# Altium schematic sheet Microcontroller.SchDoc: MCU & Power management
size 420 x 297 mm; ENG_APP_DATE: --/--/--; DSN_APP_DATE: --/--/--; CHK_APP_DATE: --/--/--
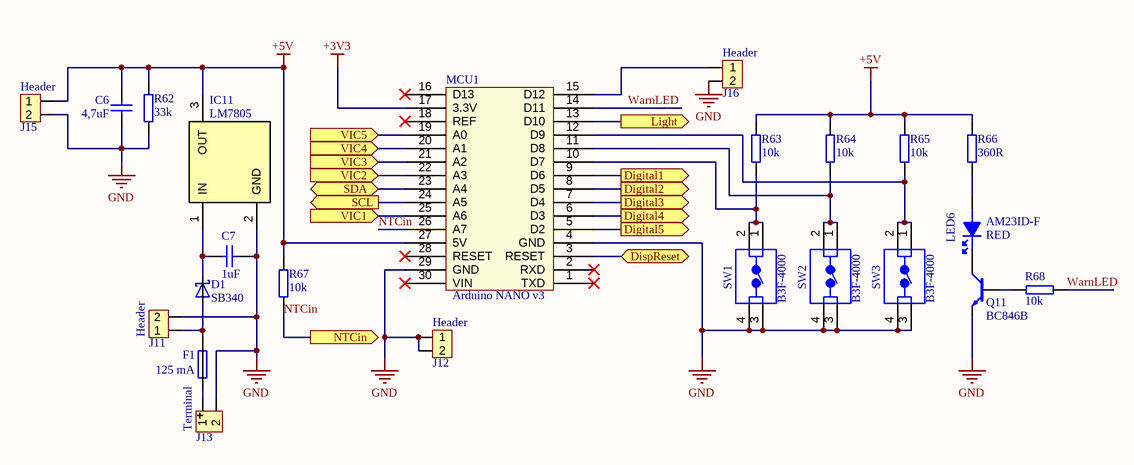
[diagram p0: Microcontroller.SchDoc]

## Parts
C6  Name: 4,7uF  [C_0805]  (hidden comment: 4,7uF_35V)
C7  Name: 1uF  [C_0805]  (hidden comment: 1uF_35V)
D1  Name: SB340  [DO-201AD]  (hidden comment: SB340_DO-201AD)
F1  value 125 mA  [FUSE_5x20]  (hidden comment: PTF0078P)
IC11  Name: LM7805  [TO220]  (hidden comment: LM7805_TO220)
J11  Name: Header  [HDR_1x2_2.54mm-MALE]  (hidden comment: 2.54mm pitch)
J12  Name: Header  [HDR_1x2_2.54mm-MALE]  (hidden comment: 2.54mm pitch)
J13  Name: Terminal  [TERMINAL_90_5MM]  (hidden comment: 5mm pitch)
J15  Name: Header  [HDR_1x2_2.54mm-MALE]  (hidden comment: 2.54mm pitch)
J16  Name: Header  [HDR_1x2_2.54mm-MALE]  (hidden comment: 2.54mm pitch)
LED6  Name: RED  Manufacturer Part Number: AM23ID-F  [LED_SOT23]  (hidden comment: LED_SOT23)
MCU1  Name: Arduino NANO v3  [Arduino_Nano_V3.0]  (hidden comment: Arduino NANO v 3.0)
Q11  Name: BC846B  [NPN_BJT_SOT23]  (hidden comment: BC846B_SOT23)
R62  Name: 33k  [R_0805]  (hidden comment: 33k_125mW)
R63  Name: 10k  [R_0805]  (hidden comment: 10k_125mW)
R64  Name: 10k  [R_0805]  (hidden comment: 10k_125mW)
R65  Name: 10k  [R_0805]  (hidden comment: 10k_125mW)
R66  Name: 360R  [R_0805]  (hidden comment: 360R_125mW)
R67  Name: 10k  [R_0805]  (hidden comment: 10k_125mW)
R68  Name: 10k  [R_0805]  (hidden comment: 10k_125mW)
SW1  B3F-4000  [PUSH_BUTTON]
SW2  B3F-4000  [PUSH_BUTTON]
SW3  B3F-4000  [PUSH_BUTTON]

## Ports
Digital1 (out), Digital2 (out), Digital3 (out), Digital4 (out), Digital5 (out), DispReset (bidir), Light (out), NTCin (out), SCL (out), SDA (bidir), VIC1 (in), VIC2 (in), VIC3 (in), VIC4 (in), VIC5 (in)

## Nets
+3V3: MCU1.17(3.3V)
+5V: C6.2 IC11.3(OUT) J15.1 MCU1.27(5V) R62.1 R63.2 R64.2 R65.2 R66.1 R67.1
GND: C6.1 C7.2 IC11.2(GND) J11.2 J12.1 J12.2 J13.2 J15.2 J16.2 MCU1.4(GND) MCU1.29(GND) Q11.3(E) R62.2 SW1.3 SW1.4 SW2.3 SW2.4 SW3.3 SW3.4
Digital1: MCU1.9(D6) ; port Digital1
Digital2: MCU1.8(D5) ; port Digital2
Digital3: MCU1.7(D4) ; port Digital3
Digital4: MCU1.6(D3) ; port Digital4
Digital5: MCU1.5(D2) ; port Digital5
DispReset: MCU1.3(RESET) ; port DispReset
Light: MCU1.13(D10) ; port Light
NTCin: MCU1.26(A7) R67.2 ; port NTCin
SCL: MCU1.24(A5) ; port SCL
SDA: MCU1.23(A4) ; port SDA
VIC1: MCU1.25(A6) ; port VIC1
VIC2: MCU1.22(A3) ; port VIC2
VIC3: MCU1.21(A2) ; port VIC3
VIC4: MCU1.20(A1) ; port VIC4
VIC5: MCU1.19(A0) ; port VIC5
WarnLED: MCU1.14(D11) R68.1
NetC7_1: C7.1 D1.2 IC11.1(IN)
NetD1_1: D1.1 F1.2 J11.1
NetF1_1: F1.1 J13.1
NetJ16_1: J16.1 MCU1.15(D12)
NetLED6_1: LED6.1(A) R66.2
NetLED6_3: LED6.3(K) Q11.1(C)
NetMCU1_10: MCU1.10(D7) R63.1 SW1.1 SW1.2
NetMCU1_11: MCU1.11(D8) R64.1 SW2.1 SW2.2
NetMCU1_12: MCU1.12(D9) R65.1 SW3.1 SW3.2
NetQ11_2: Q11.2(B) R68.2

Not connected (* = marked no-connect by the designer): MCU1 1(TXD)* 2(RXD)* 16(D13)* 18(REF)* 28(RESET)* 30(VIN)*

## Notes on the sheet
- THIS DOCUMENT AND THE DATA DISCLOSED HEREIN OR
- HEREWITH IS THE PROPERTY OF ALTIUM LIMITED AND MAY
- DWG NO:
- REVISION
- REV:
- DESCRIPTION
- DATE
- APPROVED
- BE FREELY DISTRIBUTED IN WHOLE. NO RIGHTS ARE
- RESERVED OR EXPRESS OR IMPLIED WARANTEE GIVEN.
- ENG:
- APPROVALS
- PROJECT
- DSN:
- CHK:
- REFERENCE DOCUMENTS
- PROJECT REVISION:
- TITLE
- DOCUMENT REVISION:
- DESIGN ITEM:
- BOM:
- FAB DWG:
- PCB DWG:
- ASSY DWG:
- SCALE:
- A3
- SIZE
- CAGE CODE
- FILE NAME
- DWG NO.
- SHEET
- OF
- REV

## Library data of the parts
C6 = C_4,7uF_0805: Capacitor [SMD]; Manufacturer: Murata; Manufacturer Part Number: GRM21BR61H475KE51L; Capacitance: 4.7uF; Dielectric: X5R; Material: Ceramic; Tolerance: 10%; Voltage Rating: 50V; ComponentLink1Description: DATASHEET; ComponentLink1URL: https://hr.mouser.com/datasheet/2/281/1/GRM21BR61H475KE51_01A-1987025.pdf; ComponentLink2Description: BUY; ComponentLink2URL: https://hr.mouser.com/ProductDetail/Murata-Electronics/GRM21BR61H475KE51L?qs=eeBpzGFlv%252B%252BOtLzDC1PY6Q%3D%3D; Supplier 1: Mouser; Supplier Part Number 1: 81-GRM21BR61H475KE1L; Case Code (Imperial): 0805; Case Code (Metric): 2012; Case/Package: 0805; Depth: 1.25mm; Height: 1.25mm; Lead Free: Lead Free; Length: 2mm; Max Operating Temperature: 85°C; Min Operating Temperature: -55°C; Mount: Surface Mount; Packaging: Tape and Reel; REACH SVHC: No SVHC; RoHS Compliant: Yes; Thickness: 0.055inch; Voltage Rating (DC): 50V; Width: 0.049inch; Supplier Packaging 1: Tape & Reel; Supplier Unit Price 1: $0.35; Supplier Location 1: US
C7 = C_1uF_0805: Capacitor [SMD]; Manufacturer: Murata; Manufacturer Part Number: GCJ21BR71H105KA01L; Dielectric: X7R; Tolerance: 10%; Voltage Rating: 50V; ComponentLink1Description: DATASHEET; ComponentLink1URL: https://hr.mouser.com/datasheet/2/281/GCJ21BR71H105KA01_01-1963894.pdf; ComponentLink2Description: BUY; ComponentLink2URL: https://hr.mouser.com/ProductDetail/Murata-Electronics/GCJ21BR71H105KA01L?qs=hNud%2FORuBR3CJcLH9kX5%252Bw%3D%3D; Supplier 1: Mouser; Supplier Part Number 1: 81-GCJ21BR71H105KA1L; Capacitance: 1uF; Case Code (Imperial): 0805; Case Code (Metric): 2012; Case/Package: 0805; Features: Soft Termination; Height: 1.25mm; Lead Free: Lead Free; Length: 0.079inch; Max Operating Temperature: 125°C; Min Operating Temperature: -55°C; Mount: Surface Mount; Package Quantity: 3000; Packaging: Tape and Reel; Ratings: AEC-Q200; RoHS Compliant: Yes; Termination: SMD/SMT; Thickness: 0.057inch; Voltage Rating (DC): 50V; Weight: 0.000335oz; Width: 0.049inch; Supplier Packaging 1: Tape & Reel; Supplier Unit Price 1: $0.32; Supplier Location 1: US
D1 = SB340_DO-201AD: Diode Schottky 40V 3A [TH]; Manufacturer: Vishay Semiconductors; Manufacturer Part Number: SB340-E3/54; MP: 1N5822; Value: SB340; MF: ON Semiconductor; Element Configuration: Single; Forward Voltage: 490mV; Max Forward Surge Current (Ifsm): 120A; Max Reverse Current: 500uA; Package: DO-201AD-201 Panjit; SnapEDA_Link: https://www.snapeda.com/parts/1N5822/ON%20Semiconductor/view-part/1356736/?ref=snap; Price: None; Availability: Unavailable; ComponentLink1Description: DATASHEET; ComponentLink1URL: https://hr.mouser.com/datasheet/2/427/VISH_S_A0001809294_1-2567748.pdf; ComponentLink2Description: BUY; ComponentLink2URL: https://hr.mouser.com/ProductDetail/Vishay-General-Semiconductor/SB340-E3-54?qs=u91jd7aysvMt27Sml4hAKw%3D%3D; Supplier 1: Mouser; Supplier Part Number 1: 625-SB340-E3/54; Average Rectified Current: 3A; Case/Package: DO-201AD; Forward Current: 3A; Height: 5.8mm; Lead Free: Lead Free; Length: 10mm; Max Operating Temperature: 125°C; Max Repetitive Reverse Voltage (Vrrm): 40V; Max Reverse Leakage Current: 500uA; Max Reverse Voltage (DC): 40V; Max Surge Current: 120A; Min Operating Temperature: -65°C; Mount: Through Hole; Number of Pins: 2; Package Quantity: 1400; Packaging: Tape and Reel; Peak Non-Repetitive Surge Current: 120A; Radiation Hardening: No; REACH SVHC: Unknown; RoHS Compliant: Yes; Series: -; Width: 5.8mm; Supplier Packaging 1: Tape & Reel; Supplier Unit Price 1: $0.46; Supplier Location 1: US
F1 = PTF0078P: Fuse holder [TH]; Manufacturer: Littelfuse; Manufacturer Part Number: 0PTF0078P; MP: 4527; MF: Keystone; Name: Fuse 1A; Number of Circuits: 1; Price: None; Availability: Unavailable; SnapEDA_Link: https://www.snapeda.com/parts/4527/Keystone%20Electronics/view-part/475964/?ref=snap; Package: None; ComponentLink1Description: DATASHEET; ComponentLink1URL: https://hr.mouser.com/datasheet/2/240/Littelfuse-2891966.pdf; ComponentLink2Description: BUY; ComponentLink2URL: https://hr.mouser.com/ProductDetail/Littelfuse/0PTF0078P?qs=Co4VkB5J4%2Fsczy6gG8s%2FsA%3D%3D; Supplier 1: Mouser; Supplier Part Number 1: 576-0PTF0078P; Mount: PCB; Package Quantity: 2000; Packaging: Bulk; Termination: PC Pin; Supplier Packaging 1: Bulk; Supplier Unit Price 1: $0.59; Supplier Location 1: US
IC11 = LM7805_TO220: Linear Voltage Regulator 5V [TH] with thermal pad mounted to Fischer elektronik SK09 - 20mm heatsink with a screw and nut; Manufacturer: STMicroelectronics; Manufacturer Part Number: L7805C-V; MP: LM7805CT; MF: ON Semiconductor; Dropout Voltage: 2V; Max Input Voltage: 35V; Max Output Current: 1.5A; Min Input Voltage: 7V; Number of Outputs: 1; Output Configuration: Positive; Output Type: Fixed; Power Supply Rejection Ratio (PSRR): 62dB; Quiescent Current: 8mA; Tolerance: 5%; SnapEDA_Link: https://www.snapeda.com/parts/LM7805CT/ON%20Semiconductor/view-part/546231/?ref=snap; Price: None; Package: TO-220 ON Semiconductor; Value: *; Availability: Unavailable; ComponentLink1Description: Rregulator_DATASHEET; ComponentLink1URL: https://hr.mouser.com/datasheet/2/389/cd00000444-1795274.pdf; ComponentLink2Description: Regulator_BUY; ComponentLink2URL: https://hr.mouser.com/ProductDetail/STMicroelectronics/L7805CV?qs=9NrABl3fj%2FqplZAHiYUxWg%3D%3D; Supplier 1: Mouser; Supplier Part Number 1: 511-L7805CV; Case/Package: TO-220; Contact Plating: Gold; Height: 9.15mm; Lead Free: Lead Free; Length: 10.4mm; Max Operating Temperature: 125°C; Min Operating Temperature: 0°C; Min Output Voltage: 5V; Mount: Through Hole; Nominal Output Voltage: 5V; Number of Pins: 3; Number of Regulators: 1; Output Current: 1.5A; Output Voltage: 5V; Package Quantity: 1000; Packaging: Rail/Tube; Polarity: Positive; Radiation Hardening: No; REACH SVHC: No SVHC; RoHS Compliant: Yes; Series: -; Weight: 0.08113oz; Width: 4.6mm; Supplier Packaging 1: Tube; Supplier Unit Price 1: $0.63; Supplier Location 1: US; ComponentLink3Description: Heatsink_OFFICIAL PAGE; ComponentLink3URL: https://www.fischerelektronik.de/web_fischer/en_GB/heatsinks/A01/Standard%20extruded%20heatsinks/PG/SK09/search.xhtml; ComponentLink4Description: Heatsink_BUY; ComponentLink4URL: https://www.tme.eu/en/details/sk09-20sa220/heatsinks/fischer-elektronik/sk-09-20-sa-to-220/
J11 J12 J15 J16 = Header 1x2: Header, 2-Pin [TH]; Manufacturer: Molex; Current Rating: 4A; Gender: Male; Glow Wire Compliant: Non-compliant; Number of Circuits: 15; Pitch: 0.1inch; Voltage Rating: 250V; Connector Type: Male Pin; LatestRevisionDate: 17-Jul-2002; LatestRevisionNote: Re-released for DXP Platform.; Publisher: Altium Limited; ComponentLink1Description: DATASHEET; ComponentLink1URL: https://hr.mouser.com/datasheet/2/276/0022284150_PCB_HEADERS-159054.pdf; ComponentLink2Description: BUY; ComponentLink2URL: https://hr.mouser.com/ProductDetail/Molex/22-28-4150?qs=M5Ic86%252BuP8aClMFgmZrq7g%3D%3D; Supplier 1: Mouser; Supplier Part Number 1: 538-22-28-4150; Color: Black; Contact Material: Brass; Contact Mating Length: 0.24inch; Contact Plating: Tin; Contact Type: Male Pin; Flammability Rating: UL94 V-0; Height: 2.29mm; Housing Color: Black; Housing Material: Thermoplastic; Lead Free: Contains Lead; Length: 38.1mm; Mount: Through Hole; Number of Contacts: 15; Number of Positions: 15; Number of Rows: 1; Orientation: Vertical; Package Quantity: 1; Packaging: Bulk; RoHS Compliant: Yes; Series: KK® 42375; Termination: Solder; Voltage Rating (DC): 250V; Width: 2.49mm; Supplier Packaging 1: Bulk; Supplier Unit Price 1: $0.57; Supplier Location 1: US; Manufacturer Part Number: 22-28-4150
J13 = Terminal 1x2: PCB connector, 2-Pin [TH]; Manufacturer: CUI Devices; Manufacturer Part Number: TB006-508-02BE; LatestRevisionDate: 17-Jul-2002; LatestRevisionNote: Re-released for DXP Platform.; Publisher: Altium Limited; ComponentLink1Description: DATASHEET; ComponentLink1URL: https://hr.mouser.com/datasheet/2/670/tb006_508-2306877.pdf; ComponentLink2Description: BUY; ComponentLink2URL: https://hr.mouser.com/ProductDetail/CUI-Devices/TB006-508-02BE?qs=vLWxofP3U2wEdOVV%2FaT04w%3D%3D; Supplier 1: Mouser; Supplier Part Number 1: 490-TB006-508-02BE; Supplier Unit Price 1: $0.85; Supplier Location 1: US
LED6 = LED_SOT23: Red LED [SMD]; Manufacturer: Kingbright; Dominant Wavelength: 617nm; Forward Current: 20mA; Forward Voltage: 2V; Lens Style: Diffused,Tinted; Lens Transparency: Diffused; Luminous Intensity: 7mcd; Power Rating: 75mW; Viewing Angle: 140°; Wavelength: 625nm; ComponentLink1Description: DATASHEET; ComponentLink1URL: https://hr.mouser.com/datasheet/2/216/AM23ID-F-33364.pdf; ComponentLink2Description: BUY; ComponentLink2URL: https://hr.mouser.com/ProductDetail/Kingbright/AM23ID-F?qs=y3UkhjaxUTbVf8YFp%2FiekA%3D%3D; Supplier 1: Mouser; Supplier Part Number 1: 604-AM23ID-F; Case/Package: SOT-23; Color: Red; Height: 1.2mm; Illumination Color: Red; Lead Free: Lead Free; Length: 3mm; Lens Color: Red; Max Operating Temperature: 85°C; Min Operating Temperature: -40°C; Mount: Surface Mount; Package Quantity: 2000; Packaging: Tape and Reel; RoHS Compliant: Yes; Series: -; Test Current: 20mA; Width: 1.3mm; Supplier Packaging 1: Tape & Reel; Supplier Unit Price 1: $0.50; Supplier Location 1: US
MCU1 = Arduino NANO v 3.0: Microcontroller [TH]; Manufacturer Part Number: A000005; Core Architecture: AVR; Data Bus Width: 8b; Evaluation Kit: Yes; Number of Bits: 8; Operating Supply Voltage: 20V; Interface: I2C,SPI,USB; ComponentLink1Description: OFFICIAL PAGE; ComponentLink1URL: https://store.arduino.cc/arduino-nano; Height: 0.25inch; Length: 7inch; Package Quantity: 1; Packaging: Bulk; REACH SVHC: No SVHC; Weight: 0.02lb; Width: 5inch; Manufacturer: Arduino; ComponentLink2Description: BUY; ComponentLink2URL: https://www.mouser.com/ProductDetail/Arduino/A000005?qs=FN83AlR%252Bkj%252B2HN65G4WOuA%3D%3D; Supplier 1: Mouser; Supplier Part Number 1: 782-A000005
Q11 = BC846B_SOT23: NPN transistor [SMD]; Manufacturer Part Number: BC846ALT1G; Manufacturer: ON Semiconductor; Collector Base Voltage (VCBO): 80V; Collector Emitter Breakdown Voltage: 65V; Collector Emitter Saturation Voltage: 600mV; Current Rating: 100mA; Element Configuration: Single; Emitter Base Voltage (VEBO): 6V; Frequency: 100MHz; hFE Min: 110; Max Power Dissipation: 300mW; Number of Elements: 1; ComponentLink1Description: DATASHEET; ComponentLink1URL: https://hr.mouser.com/datasheet/2/308/1/BC846ALT1_D-2310268.pdf; ComponentLink2Description: BUY; ComponentLink2URL: https://hr.mouser.com/ProductDetail/onsemi/BC846ALT1G?qs=vNc2DXHODiKaYXYnVvJi5w%3D%3D; Case/Package: SOT-23; Collector Emitter Voltage (VCEO): 65V; Collector-emitter Voltage-Max: 600mV; Contact Plating: Tin,Matte; Gain Bandwidth Product: 100MHz; Halogen Free: Halogen Free; Height: 0.94mm; Lead Free: Lead Free; Length: 2.9mm; Max Breakdown Voltage: 65V; Max Collector Current: 100mA; Max Frequency: 100MHz; Max Operating Temperature: 150°C; Min Operating Temperature: -55°C; Number of Pins: 3; Package Quantity: 1; Packaging: Tape and Reel; Polarity: NPN; Power Dissipation: 300mW; Radiation Hardening: No; REACH SVHC: No SVHC; RoHS Compliant: Yes; Series: BC846AL; Transition Frequency: 100MHz; Voltage Rating (DC): 65V; Width: 1.3mm; Supplier 1: Mouser; Supplier Part Number 1: 863-BC846ALT1G
R62 = R_33k_0805: Resistor [SMD]; Manufacturer: Vishay Dale; Manufacturer Part Number: CRCW080533K0FKEBC; Max Power Dissipation: 125mW; Resistance: 33kR; Temperature Coefficient: 100ppm/°C; Tolerance: 1%; ComponentLink1Description: DATASHEET; ComponentLink1URL: https://hr.mouser.com/datasheet/2/427/crcwce3-1762584.pdf; ComponentLink2Description: BUY; ComponentLink2URL: https://hr.mouser.com/ProductDetail/Vishay-Dale/CRCW080533K0FKEBC?qs=wd5RIQLrsJg6GD4hLX9MMA%3D%3D; Supplier 1: Mouser; Supplier Part Number 1: 71-CRCW080533K0FKEBC; Case/Package: 0805; Max Operating Temperature: 155°C; Min Operating Temperature: -55°C; Number of Terminations: 2; Packaging: Tape and Reel; Resistor Type: Thick Film; RoHS Compliant: Yes; Supplier Packaging 1: Tape & Reel; Supplier Unit Price 1: $0.16; Supplier Location 1: US
R63-R65 R67 R68 = R_10k_0805: Resistor [SMD]; Manufacturer: Vishay; Manufacturer Part Number: CRCW080510K0FKEAC; Power Rating: 125mW; Resistance: 10000R; Tolerance: 1%; ComponentLink1Description: DATASHEET; ComponentLink1URL: https://hr.mouser.com/datasheet/2/427/crcwce3-1762584.pdf; ComponentLink2Description: BUY; ComponentLink2URL: https://hr.mouser.com/ProductDetail/Vishay-Dale/CRCW080510K0FKEAC?qs=E3Y5ESvWgWORadmUijPtxQ%3D%3D; Supplier 1: Mouser; Supplier Part Number 1: 71-CRCW080510K0FKEAC; Case/Package: 0805; Lead Free: Lead Free; RoHS Compliant: Yes; Supplier Packaging 1: Tape & Reel; Supplier Unit Price 1: $0.10; Supplier Location 1: US
R66 = R_360R_0805: Resistor [SMD]; Manufacturer: Vishay; Manufacturer Part Number: CRCW0805360RFKEA; Max Power Dissipation: 125mW; Number of Terminals/Pins: 2; Temperature Coefficient: 100ppm/°C; Tolerance: 1%; Voltage Rating: 150V; ComponentLink1Description: DATASHEET; ComponentLink1URL: https://hr.mouser.com/datasheet/2/427/dcrcwe3-1762152.pdf; ComponentLink2Description: BUY; ComponentLink2URL: https://hr.mouser.com/ProductDetail/Vishay-Dale/CRCW0805360RFKEA?qs=ofC1ORbyWJdnf1jRDhIDIw%3D%3D; Supplier 1: Mouser; Supplier Part Number 1: 71-CRCW0805360RFKEA; Case Code (Imperial): 0805; Case Code (Metric): 2012; Case/Package: 0805; Contact Plating: Tin; Depth: 1.25mm; Features: Automotive AEC-Q200; Height: 0.45mm; Lead Free: Lead Free; Length: 2mm; Max Operating Temperature: 155°C; Military Standard: Not; Min Operating Temperature: -55°C; Number of Pins: 2; Number of Terminations: 2; Package Quantity: 5000; Packaging: Cut Tape; Power Rating: 125mW; Radiation Hardening: No; REACH SVHC: Unknown; Resistance: 360R; Resistor Type: Thick Film; RoHS Compliant: Yes; Series: D/CRCW E3; Technology: THICK FILM; Termination: SMD/SMT; Voltage Rating (DC): 150V; Weight: 0.000194oz; Width: 1.25mm; Supplier Packaging 1: Tape & Reel; Supplier Unit Price 1: $0.12; Supplier Location 1: US
SW1-SW3 = B3F-4000: SPST Push button [TH]; Manufacturer: Omron; MF: TE Connectivity; MP: 3-1825910-1; Actuator Color: Blue; Actuator Length: 0.8mm; Actuator Type: Standard; Contact Current Rating: 50mA; Contact Resistance: 100mR; Electrical Life: 3000000Cycles; Illumination Type: Non-Illuminated,Illuminated; Max Voltage Rating (DC): 24V; Number of Poles: 1; Operating Force: 1.27N; Switch Function: Off-Mom; Switch Travel: 0.3mm; Availability: Unavailable; SnapEDA_Link: https://www.snapeda.com/parts/3-1825910-1/TE%20Connectivity%20ALCOSWITCH%20Switches/view-part/452461/?ref=snap; Price: None; EU_RoHS_Compliance: Compliant; Package: None; TE_purchase_URL: https://www.te.com/usa-en/product-3-1825910-1.html?te_bu=Cor&te_type=disp&te_campaign=seda_glo_cor-seda-global-disp-prtnr-fy19-seda-model-bom-cta_sma-317_1&elqCampaignId=32493; Value: *; Name: B3F-4000; ComponentLink1Description: DATASHEET; ComponentLink1URL: https://hr.mouser.com/datasheet/2/307/en-b3f-13826.pdf; ComponentLink2Description: BUY; ComponentLink2URL: https://hr.mouser.com/ProductDetail/Omron-Electronics/B3F-4000?qs=sGAEpiMZZMv0NwlthflBi3MjD%252BFGR0mw; Supplier 1: Mouser; Supplier Part Number 1: 653-B3F-4000; Contact Material: Gold,Silver; Contact Plating: Silver,Gold; Contact Type: 1 maker; Current Rating: 50mA; Depth: 12mm; Height: 4.3mm; Insulation Resistance: 100MR; Lead Free: Lead Free; Length: 12mm; Max Current Rating: 50mA; Max Operating Temperature: 70°C; Mechanical Life: 3000000Cycles; Min Operating Temperature: -25°C; Mount: Through Hole,PCB; Orientation: Straight; Package Quantity: 500; Packaging: Bulk; REACH SVHC: Unknown; RoHS Compliant: Yes; Series: B3F; Termination: PC Pins; Throw Configuration: SPST; Voltage Rating (DC): 24V; Weight: 0.85g; Width: 12mm; Supplier Packaging 1: Bulk; Supplier Unit Price 1: $0.54; Supplier Location 1: US; Manufacturer Part Number: B3F-4000